# Altium schematic sheet U2S_ISP_JTAG.SchDoc
size A
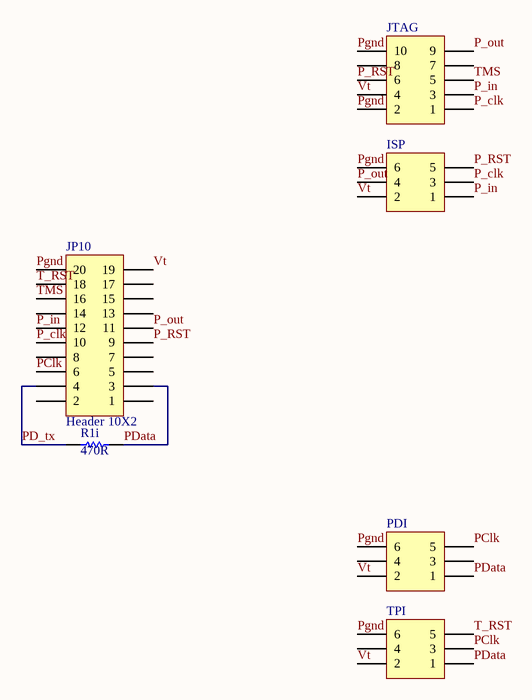
[diagram p0: U2S_ISP_JTAG.SchDoc]

## Parts
ISP  Header 3X2  [HDR2X3]  (value not drawn)
JP10  Header 10X2  [HDR2X10]
JTAG  Header 5X2  [HDR2X5]  (value not drawn)
PDI  Header 3X2  [HDR2X3]  (value not drawn)
R1i  value 470R  [SMD0805]  (hidden comment: Resistor)
TPI  Header 3X2  [HDR2X3]  (value not drawn)

## Nets
P_clk: ISP.3 JP10.10 JTAG.1
P_in: ISP.1 JP10.12 JTAG.3
P_out: ISP.4 JP10.11 JTAG.9
P_RST: ISP.5 JP10.9 JTAG.6
PClk: JP10.6 PDI.5 TPI.3
PD_tx: JP10.4 R1i.1
PData: JP10.3 PDI.1 R1i.2 TPI.1
Pgnd: ISP.6 JP10.20 JTAG.2 JTAG.10 PDI.6 TPI.6
T_RST: JP10.18 TPI.5
TMS: JP10.16 JTAG.5
Vt: ISP.2 JP10.19 JTAG.4 PDI.2 TPI.2

Not connected (* = marked no-connect by the designer): JP10 1 2 5 7 8 13 14 15 17; JTAG 7 8; PDI 3 4; TPI 4

## Library data of the parts
ISP PDI TPI = Header 3X2: Header, 3-Pin, Dual row; Revision: 17-Jul-2002: Re-released for DXP Platform.; Publisher: Altium Limited
JP10 = Header 10X2: Header, 10-Pin, Dual row; Revision: 17-Jul-2002: Re-released for DXP Platform.; Publisher: Altium Limited
JTAG = Header 5X2: Header, 5-Pin, Dual row; Revision: 17-Jul-2002: Re-released for DXP Platform.; Publisher: Altium Limited